# Altium schematic sheet EPS_MPPT_Y_EMI-Filter_Out.SchDoc: EMI Filter CH1 B
size A4; Date: 2015-10-11; Author: Piotr Kuligowski; Revision: 1-0; SheetNumber: 22; SheetTotal: 51; Model: EM1
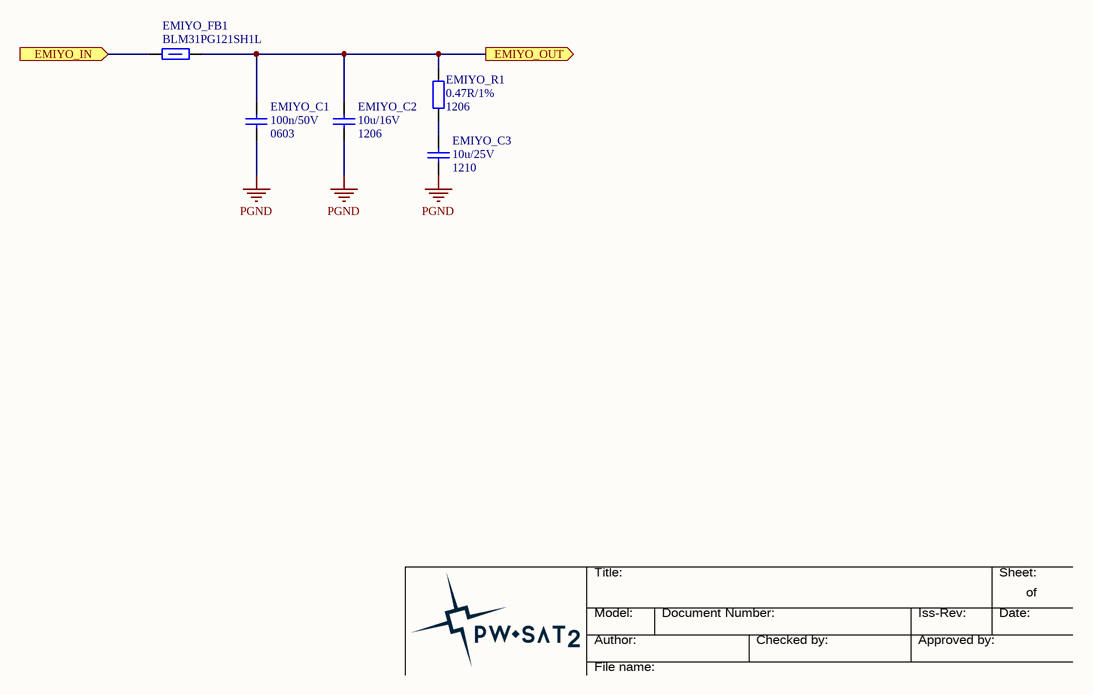
[diagram p0: EPS_MPPT_Y_EMI-Filter_Out.SchDoc]

## Parts
EMIYO_C1  Package: 0603  [SMD_Capacitor_0603]  (hidden comment: 100n/50V)
EMIYO_C2  Packge: 1206  [SMD_Capacitor_1206]  (hidden comment: 10u/16V)
EMIYO_C3  Package: 1210  [SMD_Capacitor_1210]  (hidden comment: 10u/25V)
EMIYO_FB1  120R/100MHz  [SMD_FerriteBead_1206]  (value not drawn)
EMIYO_R1  Package: 1206  [SMD_Resistor_1206]  (hidden comment: 0.47R/1%)

## Ports
EMIYO_IN (in), EMIYO_OUT (out)

## Nets
PGND: EMIYO_C1.2 EMIYO_C2.2 EMIYO_C3.2
EMIYO_IN: EMIYO_FB1.2 ; port EMIYO_IN
EMIYO_OUT: EMIYO_C1.1 EMIYO_C2.1 EMIYO_FB1.1 EMIYO_R1.2 ; port EMIYO_OUT
NetEMIYO_C3_1: EMIYO_C3.1 EMIYO_R1.1

## Notes on the sheet
- Title:
- Sheet:
- of
- Author:
- Model:
- Document Number:
- Checked by:
- Iss-Rev:
- Approved by:
- Date:
- File name:

## Library data of the parts
EMIYO_C1 = Cer_C0603T104K5RALTU: Ceramic Cap Kemet COTS 100n/50V X7R 0603; Manufacturer: Kemet; ManufacturerPartNumber: C0603T104K5RALTU; Value: 100n/50V
EMIYO_C2 = Cer_C1206T106K4RACTU: Ceramic Cap Kemet COTS 10u/16V X7R 1206; ManufacturerPartNumber: C1206T106K4RACTU; Manufacturer: Kemet; Value: 10u/16V
EMIYO_C3 = Cer_GCJ32ER71E106KA12L: Ceramic Cap Murata Automotive 10u/25V X7R 1210; Manufacturer: Murata; ManufacturerPartNumber: GCJ32ER71E106KA12L; Value: 10u/25V
EMIYO_FB1 = BLM31PG121SH1L: Ferrite bead, 1206, 0.02HM, 3.5A.; Manufacturer: Murata; Current Rating: 3.5A; Series Resistance DC: 0.02R; Package: 1206; Value: 120R/100MHz; ManufacturerPartNumber: BLM31PG121SH1L
EMIYO_R1 = ERJ-8BQFR47V: Panasonic Resistor 0.47R 1% 1206 330mW; ManufacturerPartNumber: ERJ-8BQFR47V; Manufacturer: Panasonic; Value: 0.47R/1%